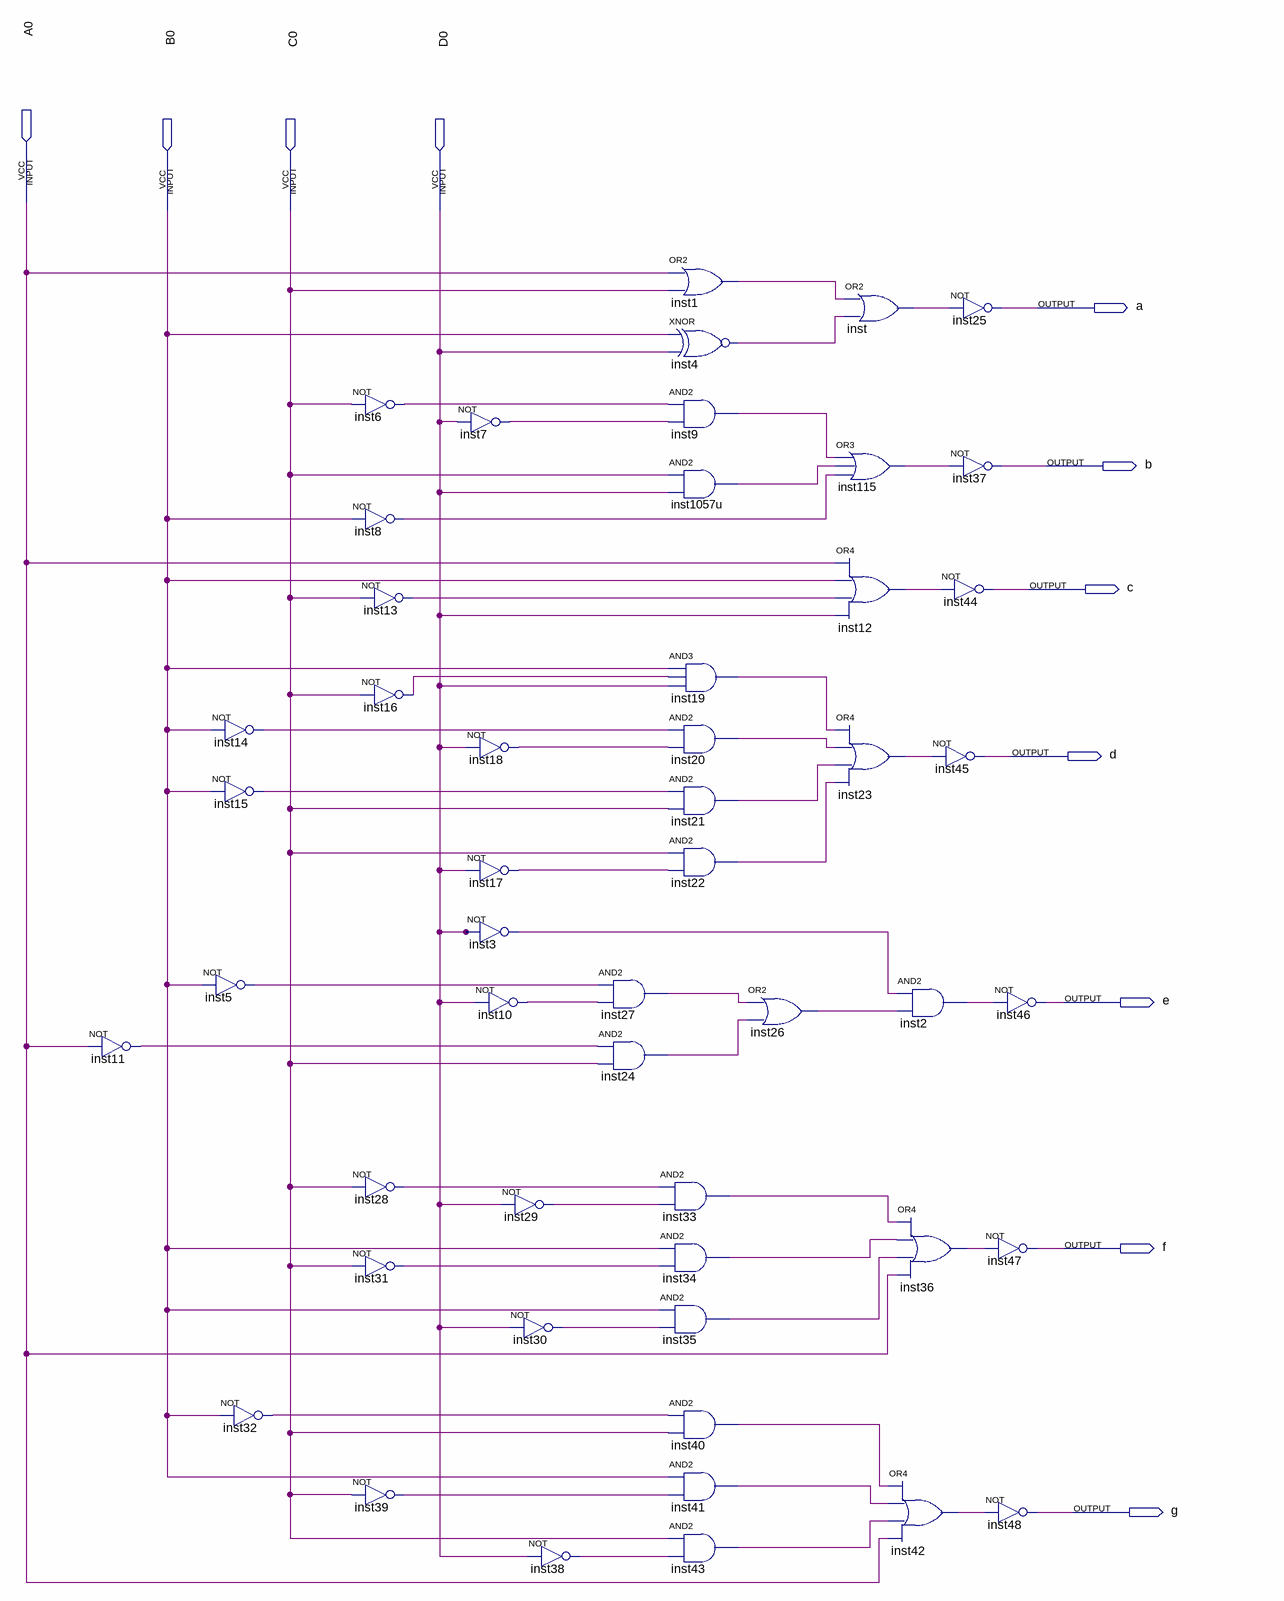
[diagram p0: schematic sheet]
// Quartus schematic sietesegmentos.bdf as structural Verilog: 51 symbols, 11 pins
module sietesegmentos (
  input  A0,
  input  B0,
  input  C0,
  input  D0,
  output a,
  output b,
  output c,
  output d,
  output e,
  output f,
  output g
);

  wire inst1_out, inst2_out, inst3_out, inst4_out, inst5_out, inst6_out, inst7_out, inst8_out, inst9_out,
       inst10_out, inst11_out, inst12_out, inst13_out, inst14_out, inst15_out, inst16_out, inst17_out,
       inst18_out, inst19_out, inst20_out, inst21_out, inst22_out, inst23_out, inst24_out, inst26_out,
       inst27_out, inst28_out, inst29_out, inst30_out, inst31_out, inst32_out, inst33_out, inst34_out,
       inst35_out, inst36_out, inst38_out, inst39_out, inst40_out, inst41_out, inst42_out, inst43_out,
       inst115_out, inst1057u_out, inst_out;

  not inst11 (inst11_out, A0);
  not inst14 (inst14_out, B0);
  not inst15 (inst15_out, B0);
  not inst5 (inst5_out, B0);
  not inst32 (inst32_out, B0);
  not inst6 (inst6_out, C0);
  not inst8 (inst8_out, B0);
  not inst13 (inst13_out, C0);
  not inst16 (inst16_out, C0);
  not inst28 (inst28_out, C0);
  not inst31 (inst31_out, C0);
  not inst39 (inst39_out, C0);
  not inst7 (inst7_out, D0);
  not inst18 (inst18_out, D0);
  not inst17 (inst17_out, D0);
  not inst3 (inst3_out, D0);
  not inst10 (inst10_out, D0);
  not inst29 (inst29_out, D0);
  not inst30 (inst30_out, D0);
  not inst38 (inst38_out, D0);
  and inst27 (inst27_out, inst5_out, inst10_out);
  and inst24 (inst24_out, inst11_out, C0);
  or inst1 (inst1_out, A0, C0);
  xnor inst4 (inst4_out, B0, D0);
  and inst9 (inst9_out, inst6_out, inst7_out);
  and inst1057u (inst1057u_out, C0, D0);
  and inst19 (inst19_out, B0, inst16_out, D0);
  and inst20 (inst20_out, inst14_out, inst18_out);
  and inst21 (inst21_out, inst15_out, C0);
  and inst22 (inst22_out, C0, inst17_out);
  and inst33 (inst33_out, inst28_out, inst29_out);
  and inst34 (inst34_out, B0, inst31_out);
  and inst35 (inst35_out, B0, inst30_out);
  and inst40 (inst40_out, inst32_out, C0);
  and inst41 (inst41_out, B0, inst39_out);
  and inst43 (inst43_out, C0, inst38_out);
  or inst26 (inst26_out, inst27_out, inst24_out);
  or inst (inst_out, inst1_out, inst4_out);
  or inst115 (inst115_out, inst9_out, inst1057u_out, inst8_out);
  or inst12 (inst12_out, A0, B0, inst13_out, D0);
  or inst23 (inst23_out, inst19_out, inst20_out, inst21_out, inst22_out);
  and inst2 (inst2_out, inst3_out, inst26_out);
  or inst36 (inst36_out, inst33_out, inst34_out, inst35_out, A0);
  or inst42 (inst42_out, inst40_out, inst41_out, inst43_out, A0);
  not inst25 (a, inst_out);
  not inst37 (b, inst115_out);
  not inst44 (c, inst12_out);
  not inst45 (d, inst23_out);
  not inst46 (e, inst2_out);
  not inst47 (f, inst36_out);
  not inst48 (g, inst42_out);
endmodule
